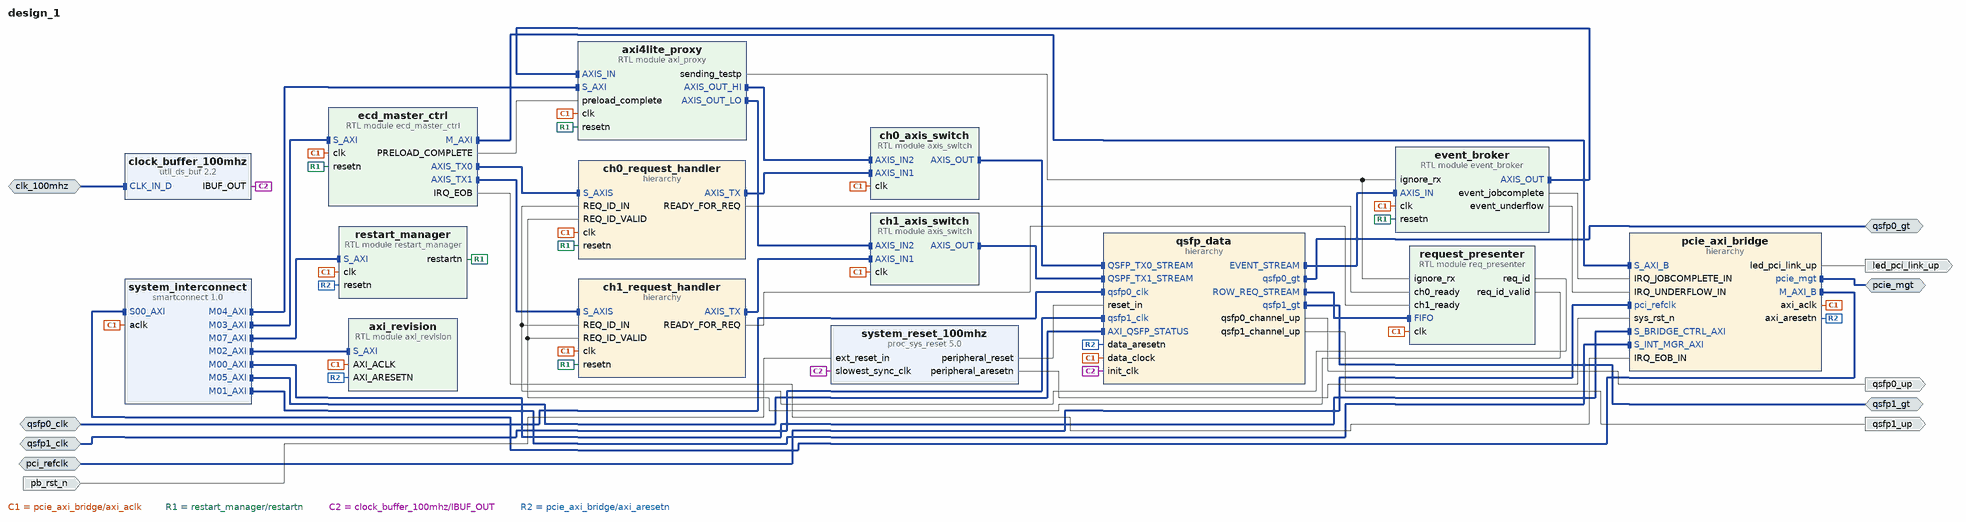
[diagram p0: block diagram of the top level]
# Vivado block design design_1, xczu19eg-ffvc1760-2-i, Vivado 2021.1
create_bd_design design_1

create_bd_intf_port -mode Slave -vlnv xilinx.com:interface:diff_clock_rtl:1.0 clk_100mhz
create_bd_intf_port -mode Slave -vlnv xilinx.com:interface:diff_clock_rtl:1.0 pci_refclk
create_bd_intf_port -mode Master -vlnv xilinx.com:interface:pcie_7x_mgt_rtl:1.0 pcie_mgt
create_bd_intf_port -mode Slave -vlnv xilinx.com:interface:diff_clock_rtl:1.0 qsfp0_clk
set_property -dict {CONFIG.FREQ_HZ 322265625} [get_bd_intf_ports qsfp0_clk]
create_bd_intf_port -mode Slave -vlnv xilinx.com:interface:diff_clock_rtl:1.0 qsfp1_clk
set_property -dict {CONFIG.FREQ_HZ 322265625} [get_bd_intf_ports qsfp1_clk]
create_bd_intf_port -mode Master -vlnv xilinx.com:interface:gt_rtl:1.0 qsfp0_gt
create_bd_intf_port -mode Master -vlnv xilinx.com:interface:gt_rtl:1.0 qsfp1_gt
create_bd_port -dir I -type rst pb_rst_n
create_bd_port -dir O led_pci_link_up
create_bd_port -dir O qsfp0_up
create_bd_port -dir O qsfp1_up

create_bd_cell -type ip -vlnv xilinx.com:ip:proc_sys_reset:5.0 system_reset_100mhz
create_bd_cell -type ip -vlnv xilinx.com:ip:util_ds_buf:2.2 clock_buffer_100mhz
create_bd_cell -type hier pcie_axi_bridge
create_bd_cell -type hier qsfp_data
create_bd_cell -type module -reference restart_manager restart_manager
create_bd_cell -type hier ch0_request_handler
create_bd_cell -type ip -vlnv xilinx.com:ip:smartconnect:1.0 system_interconnect
set_property -dict {CONFIG.HAS_ARESETN 0 CONFIG.NUM_CLKS 1 CONFIG.NUM_MI 8 CONFIG.NUM_SI 1} [get_bd_cells system_interconnect]
create_bd_cell -type module -reference ecd_master_ctrl ecd_master_ctrl
create_bd_cell -type hier ch1_request_handler
create_bd_cell -type module -reference axis_switch ch0_axis_switch
create_bd_cell -type module -reference axis_switch ch1_axis_switch
create_bd_cell -type module -reference req_presenter request_presenter
create_bd_cell -type module -reference event_broker event_broker
create_bd_cell -type module -reference axi_revision axi_revision
create_bd_cell -type module -reference axi_proxy axi4lite_proxy

# ---- hierarchy /pcie_axi_bridge ----
current_bd_instance /pcie_axi_bridge
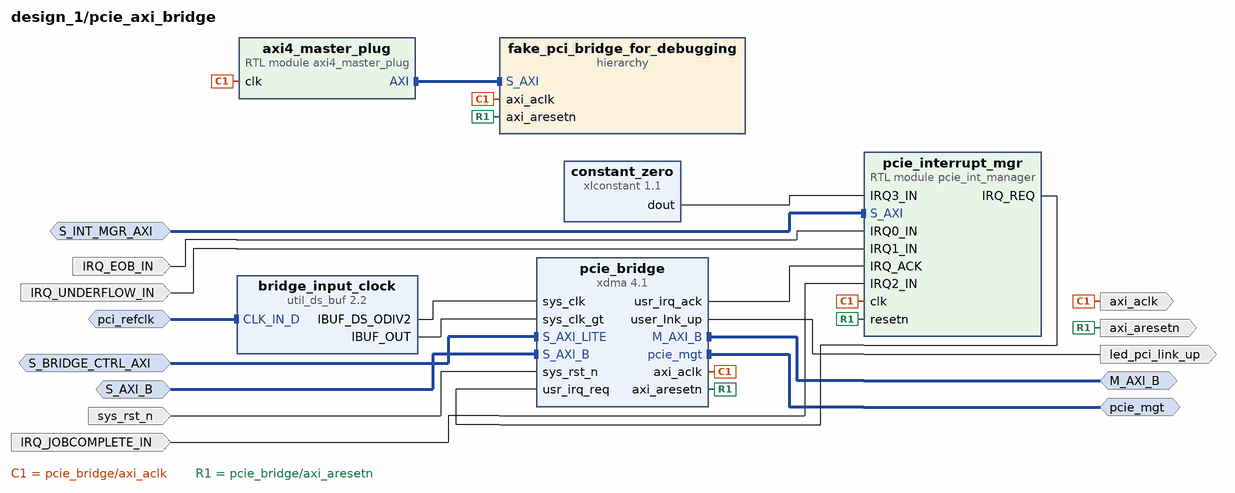
[diagram p1: block diagram inside /pcie_axi_bridge]
create_bd_intf_pin -mode Slave -vlnv xilinx.com:interface:aximm_rtl:1.0 S_BRIDGE_CTRL_AXI
create_bd_intf_pin -mode Slave -vlnv xilinx.com:interface:aximm_rtl:1.0 S_AXI_B
create_bd_intf_pin -mode Master -vlnv xilinx.com:interface:pcie_7x_mgt_rtl:1.0 pcie_mgt
create_bd_intf_pin -mode Master -vlnv xilinx.com:interface:aximm_rtl:1.0 M_AXI_B
create_bd_intf_pin -mode Slave -vlnv xilinx.com:interface:aximm_rtl:1.0 S_INT_MGR_AXI
create_bd_intf_pin -mode Slave -vlnv xilinx.com:interface:diff_clock_rtl:1.0 pci_refclk
create_bd_pin -dir O -type rst axi_aresetn
create_bd_pin -dir O -type clk axi_aclk
create_bd_pin -dir O led_pci_link_up
create_bd_pin -dir I -type rst sys_rst_n
create_bd_pin -dir I IRQ_EOB_IN
create_bd_pin -dir I IRQ_UNDERFLOW_IN
create_bd_pin -dir I IRQ_JOBCOMPLETE_IN

create_bd_cell -type ip -vlnv xilinx.com:ip:xdma:4.1 pcie_bridge
set_property -dict [list \
  CONFIG.PF0_DEVICE_ID_mqdma 903F \
  CONFIG.PF0_SRIOV_VF_DEVICE_ID A03F \
  CONFIG.PF2_DEVICE_ID_mqdma 923F \
  CONFIG.PF3_DEVICE_ID_mqdma 933F \
  CONFIG.axi_addr_width 64 \
  CONFIG.axi_data_width 512_bit \
  CONFIG.axibar2pciebar_0 0x0 \
  CONFIG.axibar_num 1 \
  CONFIG.axilite_master_en true \
  CONFIG.axilite_master_size 8 \
  CONFIG.axisten_freq 250 \
  CONFIG.bridge_burst true \
  CONFIG.c_s_axi_supports_narrow_burst false \
  CONFIG.cfg_mgmt_if false \
  CONFIG.enable_jtag_dbg true \
  CONFIG.functional_mode AXI_Bridge \
  CONFIG.mode_selection Advanced \
  CONFIG.pcie_blk_locn X1Y0 \
  CONFIG.pcie_extended_tag false \
  CONFIG.pciebar2axibar_0 0x00000000 \
  CONFIG.pciebar2axibar_1 0x800000000 \
  CONFIG.pciebar2axibar_axil_master 0A0000000 \
  CONFIG.pf0_Use_Class_Code_Lookup_Assistant false \
  CONFIG.pf0_bar0_64bit false \
  CONFIG.pf0_bar0_scale Megabytes \
  CONFIG.pf0_bar0_size 1 \
  CONFIG.pf0_bar1_enabled true \
  CONFIG.pf0_bar1_scale Megabytes \
  CONFIG.pf0_bar1_size 1 \
  CONFIG.pf0_bar2_enabled false \
  CONFIG.pf0_base_class_menu Simple_communication_controllers \
  CONFIG.pf0_class_code_base 07 \
  CONFIG.pf0_class_code_interface 01 \
  CONFIG.pf0_class_code_sub 00 \
  CONFIG.pf0_device_id 903F \
  CONFIG.pf0_interrupt_pin INTA \
  CONFIG.pf0_msi_enabled false \
  CONFIG.pf0_sub_class_interface_menu 16450_compatible_serial_controller \
  CONFIG.pf0_subsystem_id 0007 \
  CONFIG.pl_link_cap_max_link_speed 8.0_GT/s \
  CONFIG.pl_link_cap_max_link_width X16 \
  CONFIG.plltype QPLL1 \
  CONFIG.xdma_num_usr_irq 1 \
  CONFIG.xdma_sts_ports false \
  CONFIG.xdma_wnum_rids 32 \
] [get_bd_cells pcie_bridge]
create_bd_cell -type ip -vlnv xilinx.com:ip:xlconstant:1.1 constant_zero
set_property -dict {CONFIG.CONST_VAL 0 CONFIG.CONST_WIDTH 1} [get_bd_cells constant_zero]
create_bd_cell -type ip -vlnv xilinx.com:ip:util_ds_buf:2.2 bridge_input_clock
set_property -dict {CONFIG.C_BUF_TYPE IBUFDSGTE} [get_bd_cells bridge_input_clock]
create_bd_cell -type module -reference pcie_int_manager pcie_interrupt_mgr
create_bd_cell -type module -reference axi4_master_plug axi4_master_plug
set_property -dict {CONFIG.AXI_ADDR_WIDTH 64 CONFIG.AXI_DATA_WIDTH 512} [get_bd_cells axi4_master_plug]
create_bd_cell -type hier fake_pci_bridge_for_debugging

# ---- hierarchy /pcie_axi_bridge/fake_pci_bridge_for_debugging ----
current_bd_instance /pcie_axi_bridge/fake_pci_bridge_for_debugging
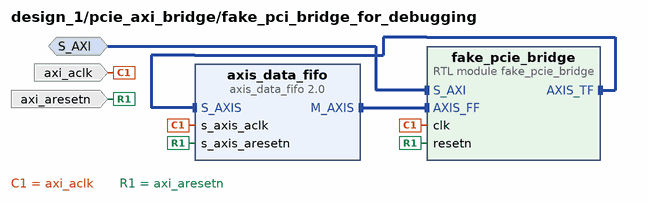
[diagram p2: block diagram inside /pcie_axi_bridge/fake_pci_bridge_for_debugging]
create_bd_intf_pin -mode Slave -vlnv xilinx.com:interface:aximm_rtl:1.0 S_AXI
create_bd_pin -dir I -type clk axi_aclk
create_bd_pin -dir I -type rst axi_aresetn

create_bd_cell -type ip -vlnv xilinx.com:ip:axis_data_fifo:2.0 axis_data_fifo
set_property -dict {CONFIG.FIFO_DEPTH 16} [get_bd_cells axis_data_fifo]
create_bd_cell -type module -reference fake_pcie_bridge fake_pcie_bridge

# ---- hierarchy /qsfp_data ----
current_bd_instance /qsfp_data
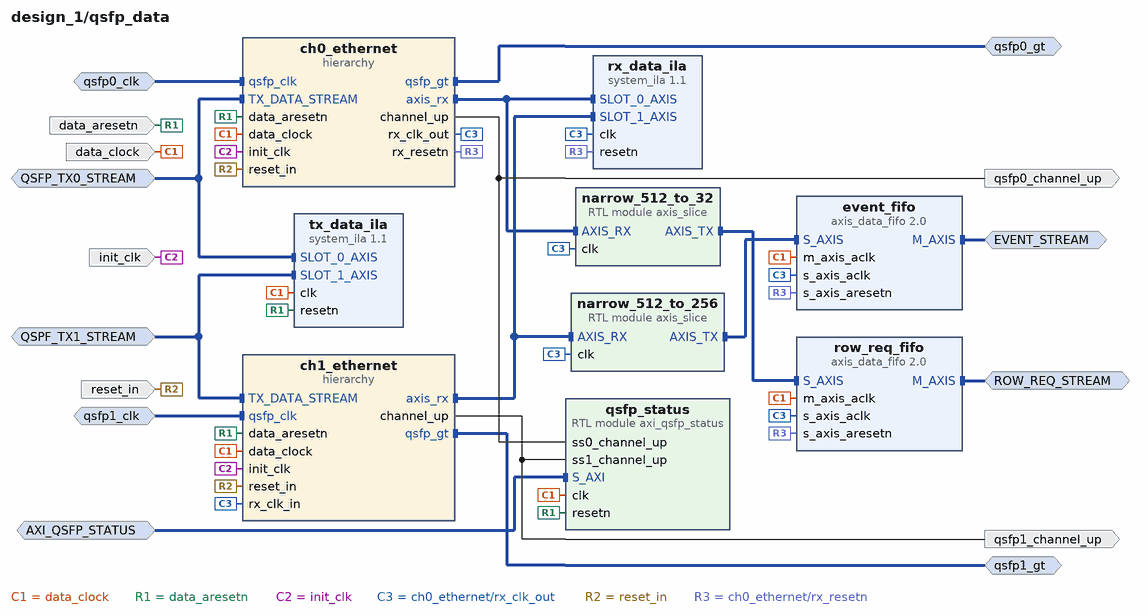
[diagram p3: block diagram inside /qsfp_data]
create_bd_intf_pin -mode Slave -vlnv xilinx.com:interface:diff_clock_rtl:1.0 qsfp0_clk
create_bd_intf_pin -mode Slave -vlnv xilinx.com:interface:diff_clock_rtl:1.0 qsfp1_clk
create_bd_intf_pin -mode Master -vlnv xilinx.com:interface:axis_rtl:1.0 ROW_REQ_STREAM
create_bd_intf_pin -mode Slave -vlnv xilinx.com:interface:axis_rtl:1.0 QSFP_TX0_STREAM
create_bd_intf_pin -mode Slave -vlnv xilinx.com:interface:aximm_rtl:1.0 AXI_QSFP_STATUS
create_bd_intf_pin -mode Master -vlnv xilinx.com:interface:axis_rtl:1.0 EVENT_STREAM
create_bd_intf_pin -mode Master -vlnv xilinx.com:interface:gt_rtl:1.0 qsfp0_gt
create_bd_intf_pin -mode Master -vlnv xilinx.com:interface:gt_rtl:1.0 qsfp1_gt
create_bd_intf_pin -mode Slave -vlnv xilinx.com:interface:axis_rtl:1.0 QSPF_TX1_STREAM
create_bd_pin -dir I -type clk init_clk
create_bd_pin -dir I -type rst reset_in
create_bd_pin -dir O qsfp0_channel_up
create_bd_pin -dir O qsfp1_channel_up
create_bd_pin -dir I -type clk data_clock
create_bd_pin -dir I -type rst data_aresetn

create_bd_cell -type ip -vlnv xilinx.com:ip:axis_data_fifo:2.0 row_req_fifo
set_property -dict {CONFIG.IS_ACLK_ASYNC 1} [get_bd_cells row_req_fifo]
create_bd_cell -type ip -vlnv xilinx.com:ip:axis_data_fifo:2.0 event_fifo
set_property -dict {CONFIG.FIFO_DEPTH 16 CONFIG.IS_ACLK_ASYNC 1} [get_bd_cells event_fifo]
create_bd_cell -type hier ch0_ethernet
create_bd_cell -type hier ch1_ethernet
create_bd_cell -type module -reference axis_slice narrow_512_to_32
set_property -dict {CONFIG.DIN_WIDTH 512 CONFIG.LOW_BIT 8} [get_bd_cells narrow_512_to_32]
create_bd_cell -type module -reference axis_slice narrow_512_to_256
set_property -dict {CONFIG.DIN_WIDTH 512 CONFIG.DOUT_WIDTH 256} [get_bd_cells narrow_512_to_256]
create_bd_cell -type module -reference axi_qsfp_status qsfp_status
create_bd_cell -type ip -vlnv xilinx.com:ip:system_ila:1.1 tx_data_ila
set_property -dict [list \
  CONFIG.C_DATA_DEPTH 2048 \
  CONFIG.C_NUM_MONITOR_SLOTS 2 \
  CONFIG.C_SLOT 1 \
  CONFIG.C_SLOT_0_INTF_TYPE xilinx.com:interface:axis_rtl:1.0 \
  CONFIG.C_SLOT_1_INTF_TYPE xilinx.com:interface:axis_rtl:1.0 \
] [get_bd_cells tx_data_ila]
create_bd_cell -type ip -vlnv xilinx.com:ip:system_ila:1.1 rx_data_ila
set_property -dict [list \
  CONFIG.C_DATA_DEPTH 2048 \
  CONFIG.C_MON_TYPE INTERFACE \
  CONFIG.C_NUM_MONITOR_SLOTS 2 \
  CONFIG.C_SLOT 1 \
  CONFIG.C_SLOT_0_INTF_TYPE xilinx.com:interface:axis_rtl:1.0 \
  CONFIG.C_SLOT_1_INTF_TYPE xilinx.com:interface:axis_rtl:1.0 \
  CONFIG.C_SLOT_2_APC_EN 0 \
  CONFIG.C_SLOT_2_AXI_DATA_SEL 1 \
  CONFIG.C_SLOT_2_AXI_TRIG_SEL 1 \
  CONFIG.C_SLOT_2_INTF_TYPE xilinx.com:interface:axis_rtl:1.0 \
] [get_bd_cells rx_data_ila]

# ---- hierarchy /qsfp_data/ch0_ethernet ----
current_bd_instance /qsfp_data/ch0_ethernet
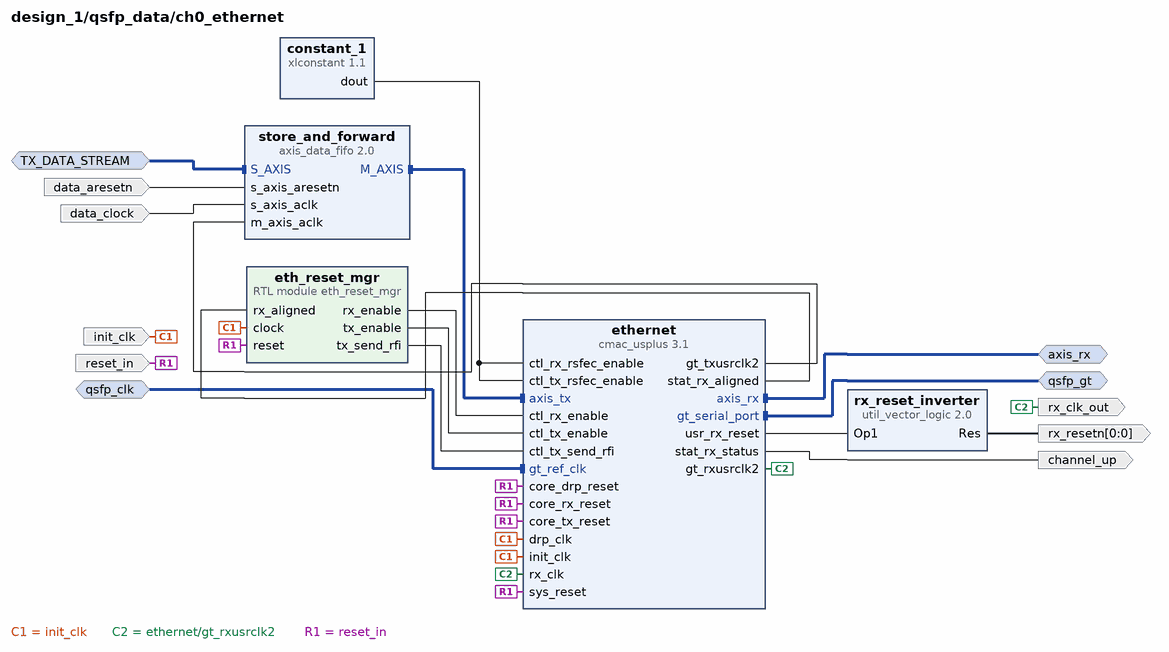
[diagram p4: block diagram inside /qsfp_data/ch0_ethernet]
create_bd_intf_pin -mode Master -vlnv xilinx.com:interface:gt_rtl:1.0 qsfp_gt
create_bd_intf_pin -mode Slave -vlnv xilinx.com:interface:diff_clock_rtl:1.0 qsfp_clk
create_bd_intf_pin -mode Master -vlnv xilinx.com:interface:axis_rtl:1.0 axis_rx
create_bd_intf_pin -mode Slave -vlnv xilinx.com:interface:axis_rtl:1.0 TX_DATA_STREAM
create_bd_pin -dir I -type rst reset_in
create_bd_pin -dir I -type clk init_clk
create_bd_pin -dir O -type clk rx_clk_out
create_bd_pin -dir O channel_up
create_bd_pin -dir I -type rst data_aresetn
create_bd_pin -dir I -type clk data_clock
create_bd_pin -dir O -from 0 -to 0 rx_resetn

create_bd_cell -type ip -vlnv xilinx.com:ip:cmac_usplus:3.1 ethernet
set_property -dict [list \
  CONFIG.CMAC_CAUI4_MODE 1 \
  CONFIG.CMAC_CORE_SELECT CMACE4_X0Y1 \
  CONFIG.GT_GROUP_SELECT {X0Y12~X0Y15} \
  CONFIG.GT_REF_CLK_FREQ 322.265625 \
  CONFIG.INCLUDE_RS_FEC 1 \
  CONFIG.INS_LOSS_NYQ 20 \
  CONFIG.NUM_LANES 4x25 \
  CONFIG.RX_FLOW_CONTROL 0 \
  CONFIG.TX_FLOW_CONTROL 0 \
  CONFIG.USER_INTERFACE AXIS \
] [get_bd_cells ethernet]
create_bd_cell -type module -reference eth_reset_mgr eth_reset_mgr
create_bd_cell -type ip -vlnv xilinx.com:ip:util_vector_logic:2.0 rx_reset_inverter
set_property -dict {CONFIG.C_OPERATION not CONFIG.C_SIZE 1} [get_bd_cells rx_reset_inverter]
create_bd_cell -type ip -vlnv xilinx.com:ip:axis_data_fifo:2.0 store_and_forward
set_property -dict {CONFIG.FIFO_DEPTH 128 CONFIG.FIFO_MODE 2 CONFIG.IS_ACLK_ASYNC 1} [get_bd_cells store_and_forward]
create_bd_cell -type ip -vlnv xilinx.com:ip:xlconstant:1.1 constant_1

# ---- hierarchy /qsfp_data/ch1_ethernet ----
current_bd_instance /qsfp_data/ch1_ethernet
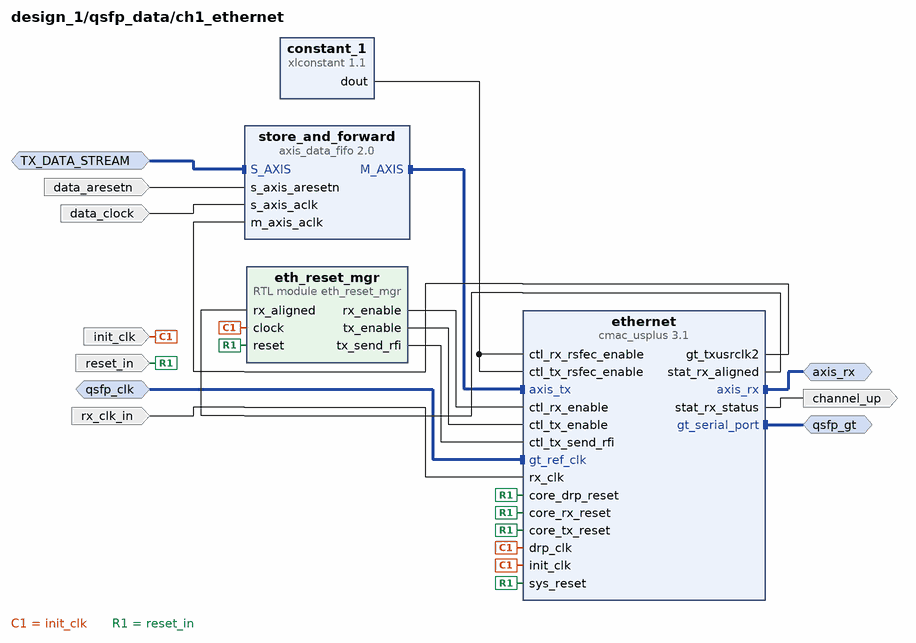
[diagram p5: block diagram inside /qsfp_data/ch1_ethernet]
create_bd_intf_pin -mode Master -vlnv xilinx.com:interface:gt_rtl:1.0 qsfp_gt
create_bd_intf_pin -mode Slave -vlnv xilinx.com:interface:diff_clock_rtl:1.0 qsfp_clk
create_bd_intf_pin -mode Master -vlnv xilinx.com:interface:axis_rtl:1.0 axis_rx
create_bd_intf_pin -mode Slave -vlnv xilinx.com:interface:axis_rtl:1.0 TX_DATA_STREAM
create_bd_pin -dir I -type rst reset_in
create_bd_pin -dir I -type clk init_clk
create_bd_pin -dir O channel_up
create_bd_pin -dir I -type rst data_aresetn
create_bd_pin -dir I -type clk data_clock
create_bd_pin -dir I -type clk rx_clk_in

create_bd_cell -type ip -vlnv xilinx.com:ip:cmac_usplus:3.1 ethernet
set_property -dict [list \
  CONFIG.CMAC_CAUI4_MODE 1 \
  CONFIG.CMAC_CORE_SELECT CMACE4_X0Y2 \
  CONFIG.GT_GROUP_SELECT {X0Y16~X0Y19} \
  CONFIG.GT_REF_CLK_FREQ 322.265625 \
  CONFIG.INCLUDE_RS_FEC 1 \
  CONFIG.INS_LOSS_NYQ 20 \
  CONFIG.NUM_LANES 4x25 \
  CONFIG.RX_FLOW_CONTROL 0 \
  CONFIG.TX_FLOW_CONTROL 0 \
  CONFIG.USER_INTERFACE AXIS \
] [get_bd_cells ethernet]
create_bd_cell -type module -reference eth_reset_mgr eth_reset_mgr
create_bd_cell -type ip -vlnv xilinx.com:ip:axis_data_fifo:2.0 store_and_forward
set_property -dict {CONFIG.FIFO_DEPTH 128 CONFIG.FIFO_MODE 2 CONFIG.IS_ACLK_ASYNC 1} [get_bd_cells store_and_forward]
create_bd_cell -type ip -vlnv xilinx.com:ip:xlconstant:1.1 constant_1

# ---- hierarchy /ch0_request_handler ----
current_bd_instance /ch0_request_handler
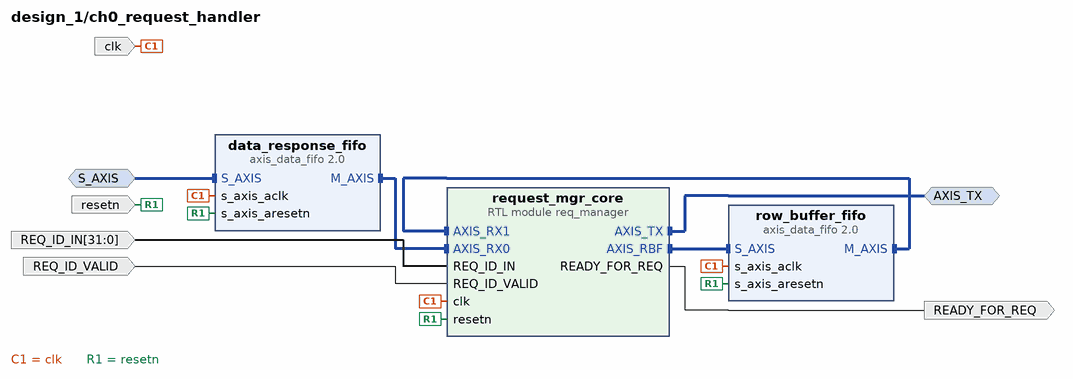
[diagram p6: block diagram inside /ch0_request_handler]
create_bd_intf_pin -mode Master -vlnv xilinx.com:interface:axis_rtl:1.0 AXIS_TX
create_bd_intf_pin -mode Slave -vlnv xilinx.com:interface:axis_rtl:1.0 S_AXIS
create_bd_pin -dir I -type clk clk
create_bd_pin -dir I resetn
create_bd_pin -dir O READY_FOR_REQ
create_bd_pin -dir I REQ_ID_VALID
create_bd_pin -dir I -from 31 -to 0 REQ_ID_IN

create_bd_cell -type ip -vlnv xilinx.com:ip:axis_data_fifo:2.0 row_buffer_fifo
set_property -dict {CONFIG.FIFO_DEPTH 64} [get_bd_cells row_buffer_fifo]
create_bd_cell -type ip -vlnv xilinx.com:ip:axis_data_fifo:2.0 data_response_fifo
set_property -dict {CONFIG.FIFO_DEPTH 4096 CONFIG.IS_ACLK_ASYNC 0} [get_bd_cells data_response_fifo]
create_bd_cell -type module -reference req_manager request_mgr_core

# ---- hierarchy /ch1_request_handler ----
current_bd_instance /ch1_request_handler
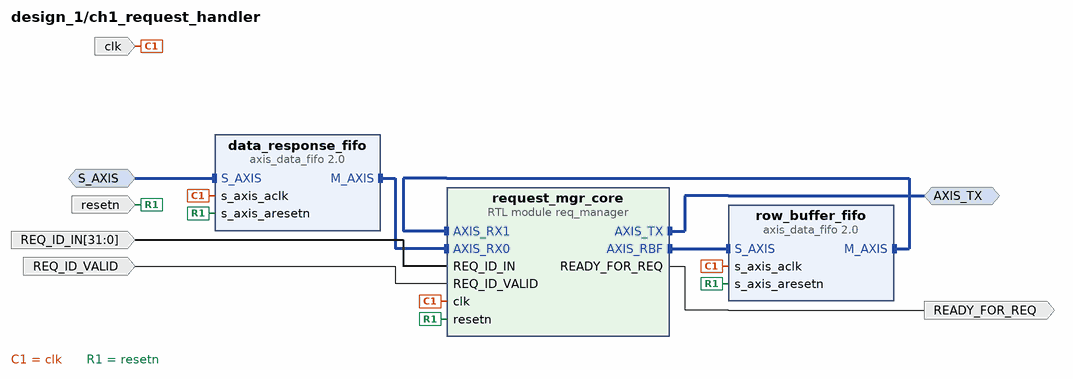
[diagram p7: block diagram inside /ch1_request_handler]
create_bd_intf_pin -mode Master -vlnv xilinx.com:interface:axis_rtl:1.0 AXIS_TX
create_bd_intf_pin -mode Slave -vlnv xilinx.com:interface:axis_rtl:1.0 S_AXIS
create_bd_pin -dir I -type clk clk
create_bd_pin -dir I resetn
create_bd_pin -dir O READY_FOR_REQ
create_bd_pin -dir I REQ_ID_VALID
create_bd_pin -dir I -from 31 -to 0 REQ_ID_IN

create_bd_cell -type ip -vlnv xilinx.com:ip:axis_data_fifo:2.0 row_buffer_fifo
set_property -dict {CONFIG.FIFO_DEPTH 64} [get_bd_cells row_buffer_fifo]
create_bd_cell -type ip -vlnv xilinx.com:ip:axis_data_fifo:2.0 data_response_fifo
set_property -dict {CONFIG.FIFO_DEPTH 4096 CONFIG.IS_ACLK_ASYNC 0} [get_bd_cells data_response_fifo]
create_bd_cell -type module -reference req_manager request_mgr_core

# ---- connections ----

current_bd_instance /pcie_axi_bridge
connect_bd_intf_net [get_bd_intf_pins S_BRIDGE_CTRL_AXI] [get_bd_intf_pins pcie_bridge/S_AXI_LITE]
connect_bd_intf_net [get_bd_intf_pins pcie_mgt] [get_bd_intf_pins pcie_bridge/pcie_mgt]
connect_bd_intf_net [get_bd_intf_pins M_AXI_B] [get_bd_intf_pins pcie_bridge/M_AXI_B]
connect_bd_intf_net [get_bd_intf_pins S_INT_MGR_AXI] [get_bd_intf_pins pcie_interrupt_mgr/S_AXI]
connect_bd_intf_net [get_bd_intf_pins pci_refclk] [get_bd_intf_pins bridge_input_clock/CLK_IN_D]
connect_bd_intf_net [get_bd_intf_pins S_AXI_B] [get_bd_intf_pins pcie_bridge/S_AXI_B]
connect_bd_intf_net [get_bd_intf_pins axi4_master_plug/AXI] [get_bd_intf_pins fake_pci_bridge_for_debugging/S_AXI]
connect_bd_net -net IRQ0_IN_1 [get_bd_pins IRQ_EOB_IN] [get_bd_pins pcie_interrupt_mgr/IRQ0_IN]
connect_bd_net -net IRQ1_IN_1 [get_bd_pins constant_zero/dout] [get_bd_pins pcie_interrupt_mgr/IRQ3_IN]
connect_bd_net -net IRQ1_IN_2 [get_bd_pins IRQ_UNDERFLOW_IN] [get_bd_pins pcie_interrupt_mgr/IRQ1_IN]
connect_bd_net -net IRQ2_IN_1 [get_bd_pins IRQ_JOBCOMPLETE_IN] [get_bd_pins pcie_interrupt_mgr/IRQ2_IN]
connect_bd_net [get_bd_pins bridge_input_clock/IBUF_DS_ODIV2] [get_bd_pins pcie_bridge/sys_clk]
connect_bd_net [get_bd_pins bridge_input_clock/IBUF_OUT] [get_bd_pins pcie_bridge/sys_clk_gt]
connect_bd_net [get_bd_pins pcie_bridge/axi_aclk] \
  [get_bd_pins axi_aclk] [get_bd_pins pcie_interrupt_mgr/clk] [get_bd_pins axi4_master_plug/clk] \
  [get_bd_pins fake_pci_bridge_for_debugging/axi_aclk]
connect_bd_net [get_bd_pins pcie_bridge/axi_aresetn] \
  [get_bd_pins axi_aresetn] [get_bd_pins pcie_interrupt_mgr/resetn] [get_bd_pins fake_pci_bridge_for_debugging/axi_aresetn]
connect_bd_net [get_bd_pins pcie_bridge/user_lnk_up] [get_bd_pins led_pci_link_up]
connect_bd_net [get_bd_pins pcie_bridge/usr_irq_ack] [get_bd_pins pcie_interrupt_mgr/IRQ_ACK]
connect_bd_net [get_bd_pins pcie_interrupt_mgr/IRQ_REQ] [get_bd_pins pcie_bridge/usr_irq_req]
connect_bd_net [get_bd_pins sys_rst_n] [get_bd_pins pcie_bridge/sys_rst_n]

current_bd_instance /pcie_axi_bridge/fake_pci_bridge_for_debugging
connect_bd_intf_net [get_bd_intf_pins S_AXI] [get_bd_intf_pins fake_pcie_bridge/S_AXI]
connect_bd_intf_net [get_bd_intf_pins fake_pcie_bridge/AXIS_FF] [get_bd_intf_pins axis_data_fifo/M_AXIS]
connect_bd_intf_net [get_bd_intf_pins fake_pcie_bridge/AXIS_TF] [get_bd_intf_pins axis_data_fifo/S_AXIS]
connect_bd_net -net pcie_bridge_axi_aclk [get_bd_pins axi_aclk] [get_bd_pins axis_data_fifo/s_axis_aclk] [get_bd_pins fake_pcie_bridge/clk]
connect_bd_net -net pcie_bridge_axi_aresetn [get_bd_pins axi_aresetn] \
  [get_bd_pins axis_data_fifo/s_axis_aresetn] [get_bd_pins fake_pcie_bridge/resetn]

current_bd_instance /qsfp_data
connect_bd_intf_net [get_bd_intf_pins ROW_REQ_STREAM] [get_bd_intf_pins row_req_fifo/M_AXIS]
connect_bd_intf_net [get_bd_intf_pins QSPF_TX1_STREAM] [get_bd_intf_pins ch1_ethernet/TX_DATA_STREAM]
connect_bd_intf_net [get_bd_intf_pins QSPF_TX1_STREAM] [get_bd_intf_pins tx_data_ila/SLOT_1_AXIS]
connect_bd_intf_net [get_bd_intf_pins qsfp1_gt] [get_bd_intf_pins ch1_ethernet/qsfp_gt]
connect_bd_intf_net [get_bd_intf_pins AXI_QSFP_STATUS] [get_bd_intf_pins qsfp_status/S_AXI]
connect_bd_intf_net [get_bd_intf_pins qsfp0_gt] [get_bd_intf_pins ch0_ethernet/qsfp_gt]
connect_bd_intf_net [get_bd_intf_pins QSFP_TX0_STREAM] [get_bd_intf_pins ch0_ethernet/TX_DATA_STREAM]
connect_bd_intf_net [get_bd_intf_pins QSFP_TX0_STREAM] [get_bd_intf_pins tx_data_ila/SLOT_0_AXIS]
connect_bd_intf_net [get_bd_intf_pins EVENT_STREAM] [get_bd_intf_pins event_fifo/M_AXIS]
connect_bd_intf_net [get_bd_intf_pins ch0_ethernet/axis_rx] [get_bd_intf_pins narrow_512_to_32/AXIS_RX]
connect_bd_intf_net [get_bd_intf_pins ch0_ethernet/axis_rx] [get_bd_intf_pins rx_data_ila/SLOT_0_AXIS]
connect_bd_intf_net [get_bd_intf_pins ch1_ethernet/axis_rx] [get_bd_intf_pins narrow_512_to_256/AXIS_RX]
connect_bd_intf_net [get_bd_intf_pins ch1_ethernet/axis_rx] [get_bd_intf_pins rx_data_ila/SLOT_1_AXIS]
connect_bd_intf_net [get_bd_intf_pins narrow_512_to_256/AXIS_TX] [get_bd_intf_pins event_fifo/S_AXIS]
connect_bd_intf_net [get_bd_intf_pins narrow_512_to_32/AXIS_TX] [get_bd_intf_pins row_req_fifo/S_AXIS]
connect_bd_intf_net [get_bd_intf_pins qsfp0_clk] [get_bd_intf_pins ch0_ethernet/qsfp_clk]
connect_bd_intf_net [get_bd_intf_pins qsfp1_clk] [get_bd_intf_pins ch1_ethernet/qsfp_clk]
connect_bd_net -net aclk_1 [get_bd_pins data_clock] \
  [get_bd_pins event_fifo/m_axis_aclk] [get_bd_pins ch1_ethernet/data_clock] [get_bd_pins ch0_ethernet/data_clock] \
  [get_bd_pins qsfp_status/clk] [get_bd_pins tx_data_ila/clk] [get_bd_pins row_req_fifo/m_axis_aclk]
connect_bd_net -net aresetn_1 [get_bd_pins data_aresetn] \
  [get_bd_pins ch1_ethernet/data_aresetn] [get_bd_pins ch0_ethernet/data_aresetn] [get_bd_pins qsfp_status/resetn] \
  [get_bd_pins tx_data_ila/resetn]
connect_bd_net -net aurora_64b66b_0_channel_up [get_bd_pins ch0_ethernet/channel_up] \
  [get_bd_pins qsfp0_channel_up] [get_bd_pins qsfp_status/ss0_channel_up]
connect_bd_net -net aurora_core_1_channel_up [get_bd_pins ch1_ethernet/channel_up] \
  [get_bd_pins qsfp1_channel_up] [get_bd_pins qsfp_status/ss1_channel_up]
connect_bd_net -net clock_1 [get_bd_pins init_clk] [get_bd_pins ch0_ethernet/init_clk] [get_bd_pins ch1_ethernet/init_clk]
connect_bd_net -net qsfp0_ethernet_gt_rxusrclk2 [get_bd_pins ch0_ethernet/rx_clk_out] \
  [get_bd_pins row_req_fifo/s_axis_aclk] [get_bd_pins narrow_512_to_32/clk] [get_bd_pins ch1_ethernet/rx_clk_in] \
  [get_bd_pins event_fifo/s_axis_aclk] [get_bd_pins narrow_512_to_256/clk] [get_bd_pins rx_data_ila/clk]
connect_bd_net [get_bd_pins reset_in] [get_bd_pins ch0_ethernet/reset_in] [get_bd_pins ch1_ethernet/reset_in]
connect_bd_net -net reset_inverter_1_Res [get_bd_pins ch0_ethernet/rx_resetn] \
  [get_bd_pins event_fifo/s_axis_aresetn] [get_bd_pins row_req_fifo/s_axis_aresetn] [get_bd_pins rx_data_ila/resetn]

current_bd_instance /qsfp_data/ch0_ethernet
connect_bd_intf_net [get_bd_intf_pins qsfp_gt] [get_bd_intf_pins ethernet/gt_serial_port]
connect_bd_intf_net [get_bd_intf_pins TX_DATA_STREAM] [get_bd_intf_pins store_and_forward/S_AXIS]
connect_bd_intf_net [get_bd_intf_pins qsfp_clk] [get_bd_intf_pins ethernet/gt_ref_clk]
connect_bd_intf_net [get_bd_intf_pins axis_rx] [get_bd_intf_pins ethernet/axis_rx]
connect_bd_intf_net [get_bd_intf_pins ethernet/axis_tx] [get_bd_intf_pins store_and_forward/M_AXIS]
connect_bd_net -net aurora_64b66b_0_channel_up [get_bd_pins ethernet/stat_rx_status] [get_bd_pins channel_up]
connect_bd_net -net clock_1 [get_bd_pins init_clk] [get_bd_pins ethernet/drp_clk] [get_bd_pins ethernet/init_clk] [get_bd_pins eth_reset_mgr/clock]
connect_bd_net [get_bd_pins constant_1/dout] [get_bd_pins ethernet/ctl_rx_rsfec_enable] [get_bd_pins ethernet/ctl_tx_rsfec_enable]
connect_bd_net [get_bd_pins data_aresetn] [get_bd_pins store_and_forward/s_axis_aresetn]
connect_bd_net [get_bd_pins data_clock] [get_bd_pins store_and_forward/s_axis_aclk]
connect_bd_net -net eth_reset_mgr_0_rx_enable [get_bd_pins eth_reset_mgr/rx_enable] [get_bd_pins ethernet/ctl_rx_enable]
connect_bd_net -net eth_reset_mgr_0_tx_enable [get_bd_pins eth_reset_mgr/tx_enable] [get_bd_pins ethernet/ctl_tx_enable]
connect_bd_net -net eth_reset_mgr_0_tx_send_rfi [get_bd_pins eth_reset_mgr/tx_send_rfi] [get_bd_pins ethernet/ctl_tx_send_rfi]
connect_bd_net [get_bd_pins ethernet/gt_txusrclk2] [get_bd_pins store_and_forward/m_axis_aclk]
connect_bd_net [get_bd_pins ethernet/stat_rx_aligned] [get_bd_pins eth_reset_mgr/rx_aligned]
connect_bd_net [get_bd_pins ethernet/usr_rx_reset] [get_bd_pins rx_reset_inverter/Op1]
connect_bd_net -net qsfp0_ethernet_gt_rxusrclk2 [get_bd_pins ethernet/gt_rxusrclk2] [get_bd_pins rx_clk_out] [get_bd_pins ethernet/rx_clk]
connect_bd_net [get_bd_pins reset_in] \
  [get_bd_pins ethernet/core_tx_reset] [get_bd_pins ethernet/core_rx_reset] [get_bd_pins ethernet/core_drp_reset] \
  [get_bd_pins ethernet/sys_reset] [get_bd_pins eth_reset_mgr/reset]
connect_bd_net [get_bd_pins rx_reset_inverter/Res] [get_bd_pins rx_resetn]

current_bd_instance /qsfp_data/ch1_ethernet
connect_bd_intf_net [get_bd_intf_pins qsfp_gt] [get_bd_intf_pins ethernet/gt_serial_port]
connect_bd_intf_net [get_bd_intf_pins TX_DATA_STREAM] [get_bd_intf_pins store_and_forward/S_AXIS]
connect_bd_intf_net [get_bd_intf_pins qsfp_clk] [get_bd_intf_pins ethernet/gt_ref_clk]
connect_bd_intf_net [get_bd_intf_pins axis_rx] [get_bd_intf_pins ethernet/axis_rx]
connect_bd_intf_net [get_bd_intf_pins store_and_forward/M_AXIS] [get_bd_intf_pins ethernet/axis_tx]
connect_bd_net -net aurora_core_1_channel_up [get_bd_pins ethernet/stat_rx_status] [get_bd_pins channel_up]
connect_bd_net -net clock_1 [get_bd_pins init_clk] [get_bd_pins ethernet/drp_clk] [get_bd_pins ethernet/init_clk] [get_bd_pins eth_reset_mgr/clock]
connect_bd_net [get_bd_pins constant_1/dout] [get_bd_pins ethernet/ctl_rx_rsfec_enable] [get_bd_pins ethernet/ctl_tx_rsfec_enable]
connect_bd_net [get_bd_pins data_aresetn] [get_bd_pins store_and_forward/s_axis_aresetn]
connect_bd_net [get_bd_pins data_clock] [get_bd_pins store_and_forward/s_axis_aclk]
connect_bd_net [get_bd_pins eth_reset_mgr/rx_enable] [get_bd_pins ethernet/ctl_rx_enable]
connect_bd_net [get_bd_pins eth_reset_mgr/tx_enable] [get_bd_pins ethernet/ctl_tx_enable]
connect_bd_net [get_bd_pins eth_reset_mgr/tx_send_rfi] [get_bd_pins ethernet/ctl_tx_send_rfi]
connect_bd_net -net ethernet_core_gt_txusrclk2 [get_bd_pins ethernet/gt_txusrclk2] [get_bd_pins store_and_forward/m_axis_aclk]
connect_bd_net [get_bd_pins ethernet/stat_rx_aligned] [get_bd_pins eth_reset_mgr/rx_aligned]
connect_bd_net [get_bd_pins reset_in] \
  [get_bd_pins ethernet/core_rx_reset] [get_bd_pins ethernet/core_tx_reset] [get_bd_pins ethernet/core_drp_reset] \
  [get_bd_pins ethernet/sys_reset] [get_bd_pins eth_reset_mgr/reset]
connect_bd_net -net rx_clk_0_1 [get_bd_pins rx_clk_in] [get_bd_pins ethernet/rx_clk]

current_bd_instance /ch0_request_handler
connect_bd_intf_net [get_bd_intf_pins S_AXIS] [get_bd_intf_pins data_response_fifo/S_AXIS]
connect_bd_intf_net [get_bd_intf_pins data_response_fifo/M_AXIS] [get_bd_intf_pins request_mgr_core/AXIS_RX0]
connect_bd_intf_net [get_bd_intf_pins AXIS_TX] [get_bd_intf_pins request_mgr_core/AXIS_TX]
connect_bd_intf_net [get_bd_intf_pins request_mgr_core/AXIS_RBF] [get_bd_intf_pins row_buffer_fifo/S_AXIS]
connect_bd_intf_net [get_bd_intf_pins row_buffer_fifo/M_AXIS] [get_bd_intf_pins request_mgr_core/AXIS_RX1]
connect_bd_net [get_bd_pins REQ_ID_IN] [get_bd_pins request_mgr_core/REQ_ID_IN]
connect_bd_net [get_bd_pins REQ_ID_VALID] [get_bd_pins request_mgr_core/REQ_ID_VALID]
connect_bd_net -net qsfp_data_user_clk_out [get_bd_pins clk] \
  [get_bd_pins row_buffer_fifo/s_axis_aclk] [get_bd_pins data_response_fifo/s_axis_aclk] [get_bd_pins request_mgr_core/clk]
connect_bd_net [get_bd_pins request_mgr_core/READY_FOR_REQ] [get_bd_pins READY_FOR_REQ]
connect_bd_net -net src_arst_1 [get_bd_pins resetn] \
  [get_bd_pins data_response_fifo/s_axis_aresetn] [get_bd_pins row_buffer_fifo/s_axis_aresetn] \
  [get_bd_pins request_mgr_core/resetn]

current_bd_instance /ch1_request_handler
connect_bd_intf_net [get_bd_intf_pins S_AXIS] [get_bd_intf_pins data_response_fifo/S_AXIS]
connect_bd_intf_net [get_bd_intf_pins request_mgr_core/AXIS_RX0] [get_bd_intf_pins data_response_fifo/M_AXIS]
connect_bd_intf_net [get_bd_intf_pins AXIS_TX] [get_bd_intf_pins request_mgr_core/AXIS_TX]
connect_bd_intf_net [get_bd_intf_pins request_mgr_core/AXIS_RBF] [get_bd_intf_pins row_buffer_fifo/S_AXIS]
connect_bd_intf_net [get_bd_intf_pins row_buffer_fifo/M_AXIS] [get_bd_intf_pins request_mgr_core/AXIS_RX1]
connect_bd_net [get_bd_pins REQ_ID_IN] [get_bd_pins request_mgr_core/REQ_ID_IN]
connect_bd_net [get_bd_pins REQ_ID_VALID] [get_bd_pins request_mgr_core/REQ_ID_VALID]
connect_bd_net -net qsfp_data_user_clk_out [get_bd_pins clk] \
  [get_bd_pins row_buffer_fifo/s_axis_aclk] [get_bd_pins data_response_fifo/s_axis_aclk] [get_bd_pins request_mgr_core/clk]
connect_bd_net [get_bd_pins request_mgr_core/READY_FOR_REQ] [get_bd_pins READY_FOR_REQ]
connect_bd_net -net src_arst_1 [get_bd_pins resetn] \
  [get_bd_pins data_response_fifo/s_axis_aresetn] [get_bd_pins row_buffer_fifo/s_axis_aresetn] \
  [get_bd_pins request_mgr_core/resetn]

current_bd_instance /
connect_bd_intf_net [get_bd_intf_ports clk_100mhz] [get_bd_intf_pins clock_buffer_100mhz/CLK_IN_D]
connect_bd_intf_net [get_bd_intf_ports qsfp0_clk] [get_bd_intf_pins qsfp_data/qsfp0_clk]
connect_bd_intf_net [get_bd_intf_ports qsfp1_clk] [get_bd_intf_pins qsfp_data/qsfp1_clk]
connect_bd_intf_net [get_bd_intf_pins axi4lite_proxy/AXIS_OUT_HI] [get_bd_intf_pins ch0_axis_switch/AXIS_IN2]
connect_bd_intf_net [get_bd_intf_pins axi4lite_proxy/AXIS_OUT_LO] [get_bd_intf_pins ch1_axis_switch/AXIS_IN2]
connect_bd_intf_net [get_bd_intf_pins ch0_axis_switch/AXIS_OUT] [get_bd_intf_pins qsfp_data/QSFP_TX0_STREAM]
connect_bd_intf_net [get_bd_intf_pins ch1_axis_switch/AXIS_OUT] [get_bd_intf_pins qsfp_data/QSPF_TX1_STREAM]
connect_bd_intf_net [get_bd_intf_pins ch1_axis_switch/AXIS_IN1] [get_bd_intf_pins ch1_request_handler/AXIS_TX]
connect_bd_intf_net [get_bd_intf_pins ecd_master_ctrl/AXIS_TX0] [get_bd_intf_pins ch0_request_handler/S_AXIS]
connect_bd_intf_net [get_bd_intf_pins ecd_master_ctrl/AXIS_TX1] [get_bd_intf_pins ch1_request_handler/S_AXIS]
connect_bd_intf_net [get_bd_intf_pins ecd_master_ctrl/M_AXI] [get_bd_intf_pins pcie_axi_bridge/S_AXI_B]
connect_bd_intf_net [get_bd_intf_pins event_broker/AXIS_OUT] [get_bd_intf_pins axi4lite_proxy/AXIS_IN]
connect_bd_intf_net [get_bd_intf_ports pci_refclk] [get_bd_intf_pins pcie_axi_bridge/pci_refclk]
connect_bd_intf_net [get_bd_intf_pins pcie_axi_bridge/M_AXI_B] [get_bd_intf_pins system_interconnect/S00_AXI]
connect_bd_intf_net [get_bd_intf_ports pcie_mgt] [get_bd_intf_pins pcie_axi_bridge/pcie_mgt]
connect_bd_intf_net [get_bd_intf_pins qsfp_data/EVENT_STREAM] [get_bd_intf_pins event_broker/AXIS_IN]
connect_bd_intf_net [get_bd_intf_pins qsfp_data/ROW_REQ_STREAM] [get_bd_intf_pins request_presenter/FIFO]
connect_bd_intf_net [get_bd_intf_ports qsfp0_gt] [get_bd_intf_pins qsfp_data/qsfp0_gt]
connect_bd_intf_net [get_bd_intf_ports qsfp1_gt] [get_bd_intf_pins qsfp_data/qsfp1_gt]
connect_bd_intf_net [get_bd_intf_pins ch0_request_handler/AXIS_TX] [get_bd_intf_pins ch0_axis_switch/AXIS_IN1]
connect_bd_intf_net [get_bd_intf_pins system_interconnect/M00_AXI] [get_bd_intf_pins pcie_axi_bridge/S_BRIDGE_CTRL_AXI]
connect_bd_intf_net [get_bd_intf_pins system_interconnect/M01_AXI] [get_bd_intf_pins pcie_axi_bridge/S_INT_MGR_AXI]
connect_bd_intf_net [get_bd_intf_pins axi_revision/S_AXI] [get_bd_intf_pins system_interconnect/M02_AXI]
connect_bd_intf_net [get_bd_intf_pins ecd_master_ctrl/S_AXI] [get_bd_intf_pins system_interconnect/M03_AXI]
connect_bd_intf_net [get_bd_intf_pins axi4lite_proxy/S_AXI] [get_bd_intf_pins system_interconnect/M04_AXI]
connect_bd_intf_net [get_bd_intf_pins system_interconnect/M05_AXI] [get_bd_intf_pins qsfp_data/AXI_QSFP_STATUS]
connect_bd_intf_net [get_bd_intf_pins restart_manager/S_AXI] [get_bd_intf_pins system_interconnect/M07_AXI]
connect_bd_net -net REQ_ID_IN_1 [get_bd_pins request_presenter/req_id] \
  [get_bd_pins ch0_request_handler/REQ_ID_IN] [get_bd_pins ch1_request_handler/REQ_ID_IN]
connect_bd_net -net REQ_ID_VALID_1 [get_bd_pins request_presenter/req_id_valid] \
  [get_bd_pins ch0_request_handler/REQ_ID_VALID] [get_bd_pins ch1_request_handler/REQ_ID_VALID]
connect_bd_net [get_bd_pins axi4lite_proxy/sending_testp] [get_bd_pins request_presenter/ignore_rx] [get_bd_pins event_broker/ignore_rx]
connect_bd_net -net ch1_request_manager_READY_FOR_REQ [get_bd_pins ch1_request_handler/READY_FOR_REQ] [get_bd_pins request_presenter/ch1_ready]
connect_bd_net -net ecd_master_ctrl_IRQ_PPB0 [get_bd_pins ecd_master_ctrl/IRQ_EOB] [get_bd_pins pcie_axi_bridge/IRQ_EOB_IN]
connect_bd_net [get_bd_pins ecd_master_ctrl/PRELOAD_COMPLETE] [get_bd_pins axi4lite_proxy/preload_complete]
connect_bd_net [get_bd_pins event_broker/event_jobcomplete] [get_bd_pins pcie_axi_bridge/IRQ_JOBCOMPLETE_IN]
connect_bd_net [get_bd_pins event_broker/event_underflow] [get_bd_pins pcie_axi_bridge/IRQ_UNDERFLOW_IN]
connect_bd_net -net ext_reset_in_0_1 [get_bd_ports pb_rst_n] [get_bd_pins system_reset_100mhz/ext_reset_in]
connect_bd_net -net ila_250mhz [get_bd_pins pcie_axi_bridge/axi_aclk] \
  [get_bd_pins restart_manager/clk] [get_bd_pins system_interconnect/aclk] [get_bd_pins qsfp_data/data_clock] \
  [get_bd_pins ch0_request_handler/clk] [get_bd_pins ecd_master_ctrl/clk] [get_bd_pins ch1_request_handler/clk] \
  [get_bd_pins ch0_axis_switch/clk] [get_bd_pins ch1_axis_switch/clk] [get_bd_pins request_presenter/clk] \
  [get_bd_pins event_broker/clk] [get_bd_pins axi_revision/AXI_ACLK] [get_bd_pins axi4lite_proxy/clk]
connect_bd_net [get_bd_pins pcie_axi_bridge/led_pci_link_up] [get_bd_ports led_pci_link_up]
connect_bd_net -net qsfp_data_channel_up_0 [get_bd_pins qsfp_data/qsfp0_channel_up] [get_bd_ports qsfp0_up]
connect_bd_net -net qsfp_data_channel_up_1 [get_bd_pins qsfp_data/qsfp1_channel_up] [get_bd_ports qsfp1_up]
connect_bd_net -net request_manager_READY_FOR_REQ [get_bd_pins ch0_request_handler/READY_FOR_REQ] [get_bd_pins request_presenter/ch0_ready]
connect_bd_net -net reset_in_1 [get_bd_pins system_reset_100mhz/peripheral_reset] [get_bd_pins qsfp_data/reset_in]
connect_bd_net -net restartn [get_bd_pins restart_manager/restartn] \
  [get_bd_pins ch0_request_handler/resetn] [get_bd_pins ecd_master_ctrl/resetn] [get_bd_pins ch1_request_handler/resetn] \
  [get_bd_pins event_broker/resetn] [get_bd_pins axi4lite_proxy/resetn]
connect_bd_net [get_bd_pins system_reset_100mhz/peripheral_aresetn] [get_bd_pins pcie_axi_bridge/sys_rst_n]
connect_bd_net -net util_ds_buf_0_IBUF_OUT [get_bd_pins clock_buffer_100mhz/IBUF_OUT] \
  [get_bd_pins system_reset_100mhz/slowest_sync_clk] [get_bd_pins qsfp_data/init_clk]
connect_bd_net -net xdma_0_axi_aresetn [get_bd_pins pcie_axi_bridge/axi_aresetn] \
  [get_bd_pins restart_manager/resetn] [get_bd_pins qsfp_data/data_aresetn] [get_bd_pins axi_revision/AXI_ARESETN]

# ---- address map ----
assign_bd_address -offset 0x0000000000000000 -range 16E -target_address_space [get_bd_addr_spaces ecd_master_ctrl/M_AXI] [get_bd_addr_segs pcie_axi_bridge/pcie_bridge/S_AXI_B/BAR0]
exclude_bd_addr_seg -offset 0x0000000000000000 -range 1 -target_address_space [get_bd_addr_spaces ecd_master_ctrl/M_AXI] [get_bd_addr_segs pcie_axi_bridge/fake_pci_bridge_for_debugging/fake_pcie_bridge/S_AXI/reg0]
assign_bd_address -offset 0x0000000000000000 -range 16E -target_address_space [get_bd_addr_spaces pcie_axi_bridge/axi4_master_plug/AXI] [get_bd_addr_segs pcie_axi_bridge/fake_pci_bridge_for_debugging/fake_pcie_bridge/S_AXI/reg0]
exclude_bd_addr_seg -offset 0x0000000000000000 -range 1 -target_address_space [get_bd_addr_spaces pcie_axi_bridge/axi4_master_plug/AXI] [get_bd_addr_segs pcie_axi_bridge/pcie_bridge/S_AXI_B/BAR0]
assign_bd_address -offset 0x0000000000000000 -range 256 -target_address_space [get_bd_addr_spaces pcie_axi_bridge/pcie_bridge/M_AXI_B] [get_bd_addr_segs axi_revision/S_AXI/reg0]
assign_bd_address -offset 0x0000000000000100 -range 256 -target_address_space [get_bd_addr_spaces pcie_axi_bridge/pcie_bridge/M_AXI_B] [get_bd_addr_segs ecd_master_ctrl/S_AXI/reg0]
assign_bd_address -offset 0x0000000000000200 -range 256 -target_address_space [get_bd_addr_spaces pcie_axi_bridge/pcie_bridge/M_AXI_B] [get_bd_addr_segs pcie_axi_bridge/pcie_interrupt_mgr/S_AXI/reg0]
assign_bd_address -offset 0x0000000000000300 -range 256 -target_address_space [get_bd_addr_spaces pcie_axi_bridge/pcie_bridge/M_AXI_B] [get_bd_addr_segs restart_manager/S_AXI/reg0]
assign_bd_address -offset 0x0000000000000400 -range 256 -target_address_space [get_bd_addr_spaces pcie_axi_bridge/pcie_bridge/M_AXI_B] [get_bd_addr_segs axi4lite_proxy/S_AXI/reg0]
assign_bd_address -offset 0x0000000000000500 -range 256 -target_address_space [get_bd_addr_spaces pcie_axi_bridge/pcie_bridge/M_AXI_B] [get_bd_addr_segs qsfp_data/qsfp_status/S_AXI/reg0]
assign_bd_address -offset 0x0000000000009000 -range 4K -target_address_space [get_bd_addr_spaces pcie_axi_bridge/pcie_bridge/M_AXI_B] [get_bd_addr_segs pcie_axi_bridge/pcie_bridge/S_AXI_LITE/CTL0]

validate_bd_design
save_bd_design
